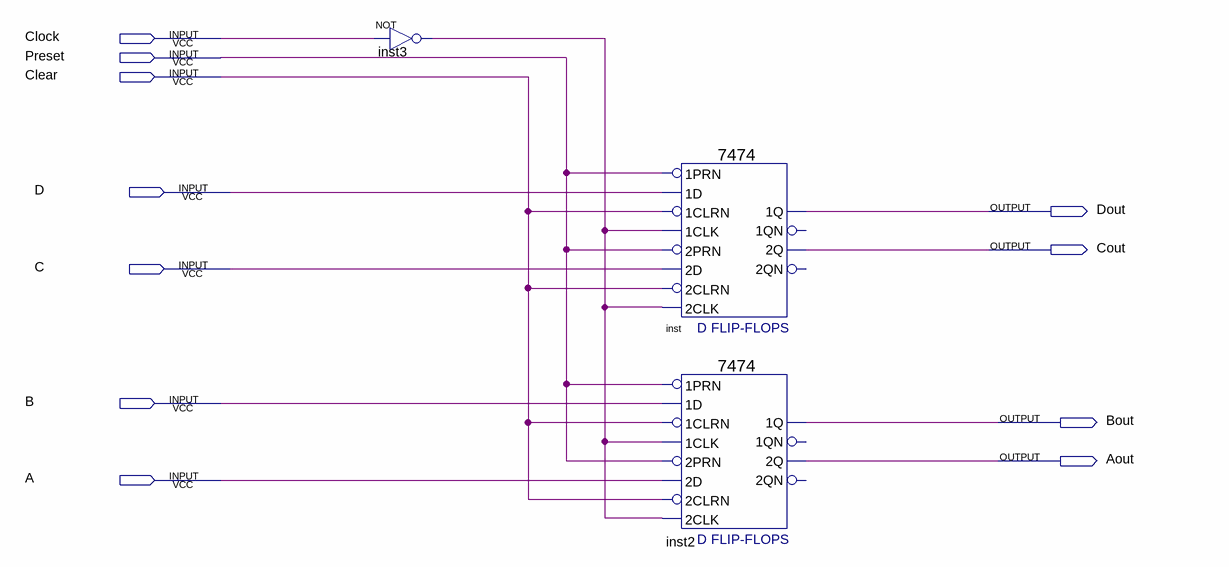
[diagram p0: schematic sheet]
// Quartus schematic Register7474.bdf as structural Verilog: 3 symbols, 11 pins
module Register7474 (
  input  Clock,
  input  Preset,
  input  Clear,
  input  D,
  input  C,
  input  B,
  input  A,
  output Dout,
  output Cout,
  output Bout,
  output Aout
);

  wire inst3_out;

  not inst3 (inst3_out, Clock);
  \7474  inst (
    .\2D (C), .\2PRN (Preset), .\1CLK (inst3_out), .\1D (D), .\1PRN (Preset), .\2CLK (inst3_out),
    .\2CLRN (Clear), .\1CLRN (Clear), .\2Q (Cout), .\1Q (Dout));  // open: 1QN, 2QN
  \7474  inst2 (
    .\2D (A), .\2PRN (Preset), .\1CLK (inst3_out), .\1D (B), .\1PRN (Preset), .\2CLK (inst3_out),
    .\2CLRN (Clear), .\1CLRN (Clear), .\2Q (Aout), .\1Q (Bout));  // open: 1QN, 2QN
endmodule
